# EAGLE design cut_off (EAGLE 7.2.0)
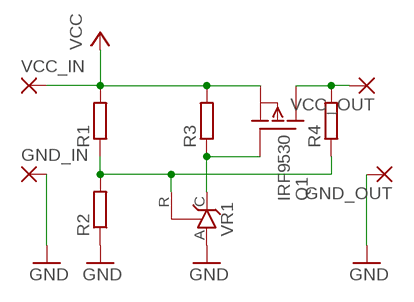
[diagram p0: schematic, sheet 1]

## Parts
GND_IN  2,15/1,0  [2,15/1,0]
GND_OUT  2,15/1,0  [2,15/1,0]
Q1  IRF9530  [TO220]
R1  R-EU_R0805  [R0805]
R2  R-EU_R0805  [R0805]
R3  R-EU_R0805  [R0805]
R4  R-EU_R0805  [R0805]
VCC_IN  2,15/1,0  [2,15/1,0]
VCC_OUT  2,15/1,0  [2,15/1,0]
VR1  TL431CLP  [TO92-CLP]

## Nets
GND: GND_IN.1(P) GND_OUT.1(P) R2.1 VR1.A
N$1: R1.1 R2.2 R4.1 VR1.R
N$3: Q1.1(G) R3.1 VR1.C
VCC: Q1.3(S) R1.2 R3.2 VCC_IN.1(P)
VCC_OUT: Q1.2(D) R4.2 VCC_OUT.1(P)

## Library data of the parts
GND_IN GND_OUT VCC_IN VCC_OUT = wirepad:2,15/1,0: THROUGH-HOLE PAD
Q1 = transistor-fet:IRF9530: P-Channel Enhancement MOSFET (HEXFET); -100V; -12A; 0,3Ohm
R1-R4 = rcl:R-EU_: RESISTOR, European symbol
VR1 = v-reg:TL431CLP: VOLTAGE REGULATOR

## Board
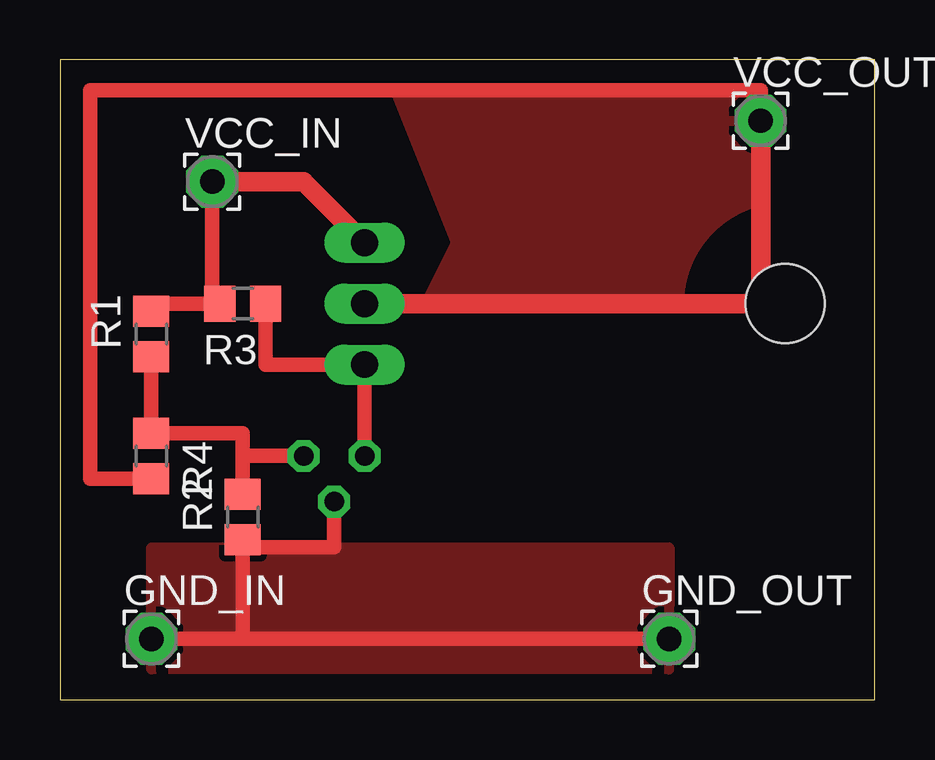
[diagram p1: board, top side]
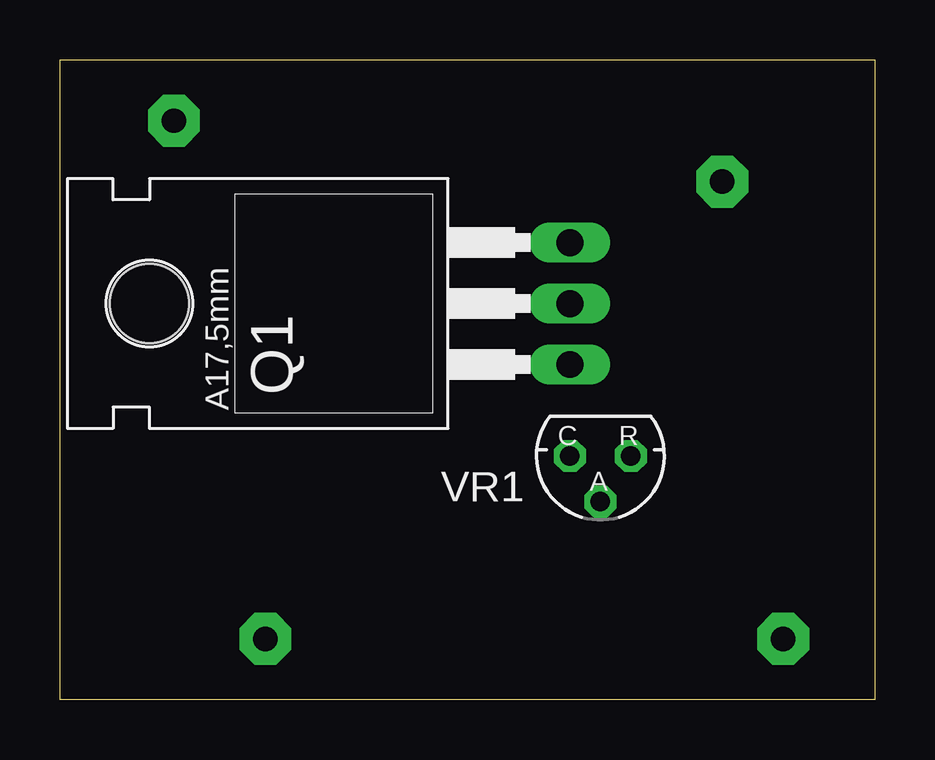
[diagram p2: board, bottom side, seen from below]

Size 33.96 x 26.66 mm. Coordinates in mm from the lower left corner, seen from the top.
Outline: 0,0 33.96,0 33.96,26.66 0,26.66 0,0
Copper layers (1*16): Top 0.035mm / dielectric 1.5mm / Bottom 0.035mm
Design rules "default": minimum track width 10mil, minimum drill 24mil, track to track 8mil, track to pad 8mil, pad to pad 8mil, via to via 8mil, smd to smd 8mil, copper to edge 40mil, drill to drill 8mil, minimum pad ring 10mil, minimum via ring 8mil, stop-mask expansion 4mil, vias tented up to drill 0mil, thermal gap 10mil

### Footprints (pad centres in the part's own frame; a part is rotated, then mirrored left to right if it is on the bottom)
2,15/1,0 = drill 1.016 pad 2.159 octagon: 1 0,0
TO220 = drill 1.118 long: 1 -2.54,-6.35; 2 0,-6.35; 3 2.54,-6.35 | hole 3.302: 0,11.176
R0805 = smd 1.3 x 1.5: 1 -0.95,0; 2 0.95,0
TO92-CLP = drill 0.813 octagon: A 0,1.905; C 1.27,0; R -1.27,0

### Placement (x,y rotation side)
GND_IN  3.81,2.54 0 top
GND_OUT  25.4,2.54 0 top
Q1  19.05,16.51 90 bottom
R1  3.81,15.24 90 top
R2  7.62,7.62 90 top
R3  7.62,16.51 180 top
R4  3.81,10.16 270 top
VCC_IN  6.35,21.59 0 top
VCC_OUT  29.21,24.13 0 top
VR1  11.43,10.16 180 bottom

### Tracks (layer width: path | path; a pad name or v marks a point on that pad's centre or on a via)
GND
  Top 0.61: 7.62,2.54 R2.1 7.62,6.35 11.43,6.35 VR1.A | GND_IN.1 7.62,2.54 | 7.62,2.54 GND_OUT.1
  pour Top: 3.81,1.27 3.81,6.35 25.4,6.35 25.4,1.27
N$1
  Top 0.61: R1.1 R4.1 7.62,11.11 7.62,10.16 | R2.2 7.62,10.16 | 7.62,10.16 VR1.R
N$3
  Top 0.61: R3.1 8.57,13.97 Q1.1 VR1.C
VCC
  Top 0.61: VCC_IN.1 6.35,16.83 R3.2 3.81,16.51 R1.2
  Top 0.813: Q1.3 10.16,21.59 VCC_IN.1
VCC_OUT
  Top 0.61: R4.2 1.27,9.21 1.27,25.4 29.21,25.4 VCC_OUT.1
  Top 0.813: Q1.2 29.21,16.51 VCC_OUT.1
  pour Top: 15.24,16.51 16.51,19.05 13.97,25.4 29.21,25.4 29.21,16.51